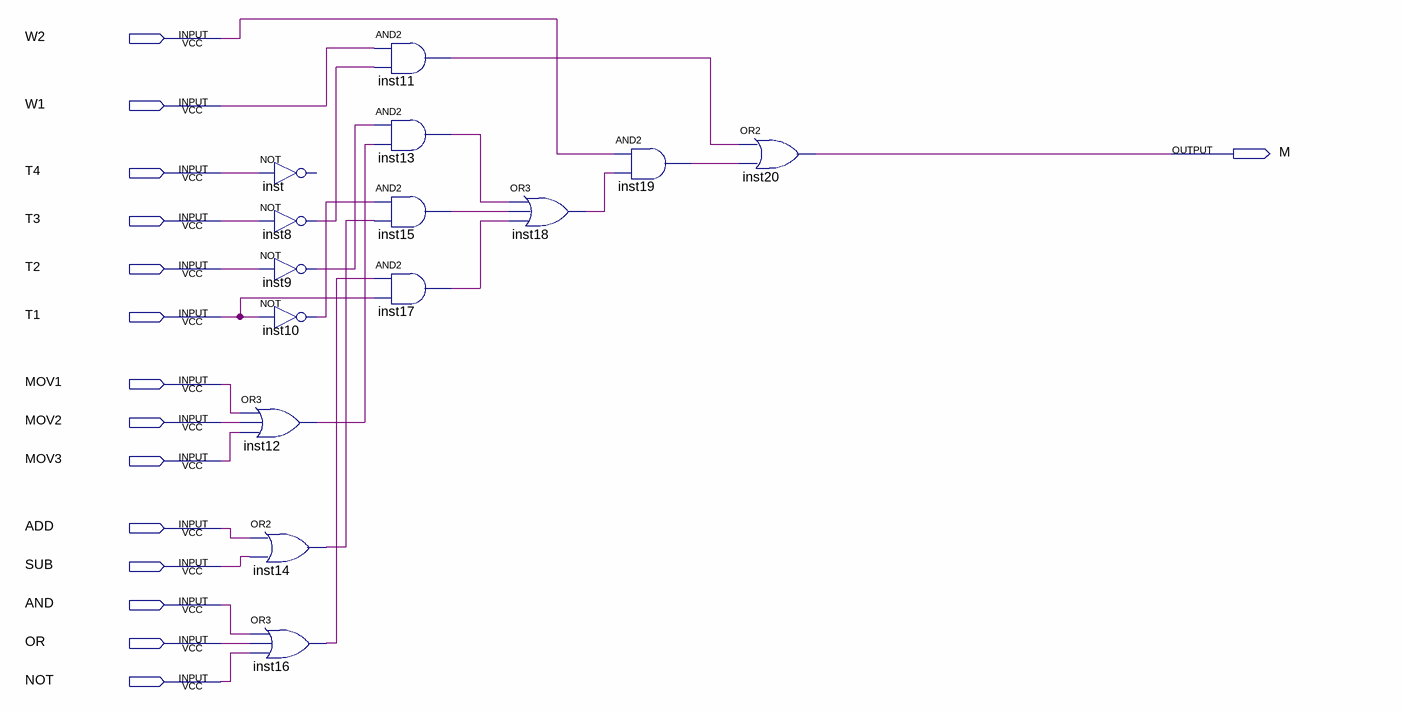
[diagram p0: schematic sheet]
// Quartus schematic M.bdf as structural Verilog: 14 symbols, 15 pins
module M (
  input  W2,
  input  W1,
  input  T4,
  input  T3,
  input  T2,
  input  T1,
  input  MOV1,
  input  MOV2,
  input  MOV3,
  input  ADD,
  input  SUB,
  input  AND,
  input  OR,
  input  NOT,
  output M
);

  wire inst8_out, inst9_out, inst10_out, inst11_out, inst12_out, inst13_out, inst14_out, inst15_out,
       inst16_out, inst17_out, inst18_out, inst19_out;

  // NOT inst has open pins: IN=T4, OUT=open
  not inst8 (inst8_out, T3);
  not inst9 (inst9_out, T2);
  not inst10 (inst10_out, T1);
  or inst12 (inst12_out, MOV1, MOV2, MOV3);
  or inst14 (inst14_out, ADD, SUB);
  or inst16 (inst16_out, AND, OR, NOT);
  and inst11 (inst11_out, W1, inst8_out);
  and inst13 (inst13_out, inst9_out, inst12_out);
  and inst15 (inst15_out, inst10_out, inst14_out);
  and inst17 (inst17_out, inst16_out, T1);
  or inst18 (inst18_out, inst13_out, inst15_out, inst17_out);
  and inst19 (inst19_out, W2, inst18_out);
  or inst20 (M, inst11_out, inst19_out);
endmodule
